# EAGLE design chess (EAGLE 7.6.0)
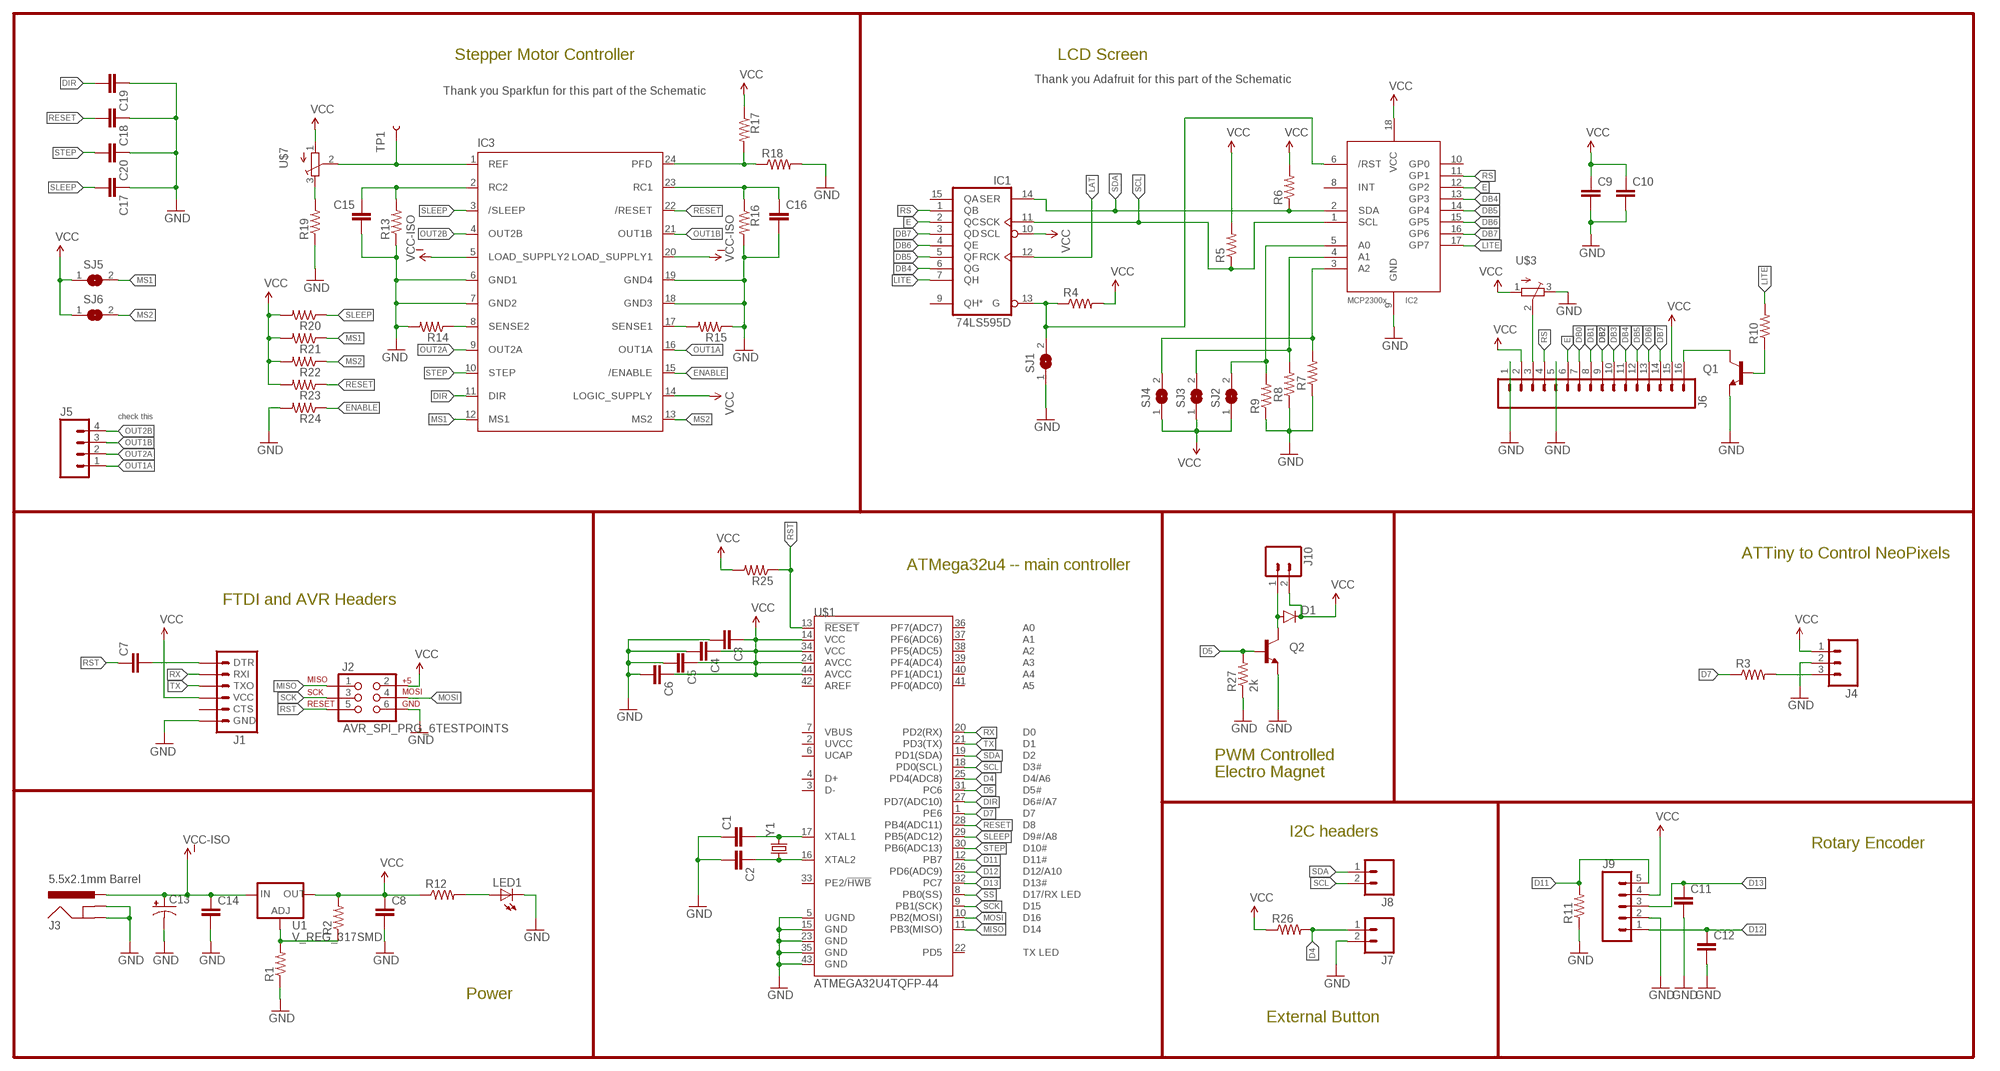
[diagram p0: schematic, sheet 1]

## Parts
C1  CAP0603-CAP  [0603-CAP]
C2  CAP0603-CAP  [0603-CAP]
C3  CAP0603-CAP  [0603-CAP]
C4  CAP0603-CAP  [0603-CAP]
C5  CAP0603-CAP  [0603-CAP]
C6  CAP0603-CAP  [0603-CAP]
C7  CAP0603-CAP  [0603-CAP]
C8  CAP0603-CAP  [0603-CAP]
C9  CAP0603-CAP  [0603-CAP]
C10  CAP0603-CAP  [0603-CAP]
C11  CAP0603-CAP  [0603-CAP]
C12  CAP0603-CAP  [0603-CAP]
C13  CAP_POL6032  [EIA6032]
C14  CAP0603-CAP  [0603-CAP]
C15  CAP0603-CAP  [0603-CAP]
C16  CAP0603-CAP  [0603-CAP]
C17  CAP0603-CAP  [0603-CAP]
C18  CAP0603-CAP  [0603-CAP]
C19  CAP0603-CAP  [0603-CAP]
C20  CAP0603-CAP  [0603-CAP]
D1  DIODEBAS16  [SOD-323]
IC1  74LS595D  [SO16]
IC2  MCP2300X/SO  [SO18W]
IC3  A3967SLB  [SO24W]
J1  ARDUINO_SERIAL_PROGRAMPTH  [1X06]
J2  AVR_SPI_PRG_6TESTPOINTS  [2X3_TEST_POINTS]
J3  5.5x2.1mm Barrel  POWER_JACKSMD  [POWER_JACK_SMD]
J4  M03PTH  [1X03]
J5  M04PTH  [1X04]
J6  M16PTH  [1X16]
J7  M02PTH  [1X02]
J8  M02PTH  [1X02]
J9  M05PTH  [1X05]
J10  M02PTH  [1X02]
LED1  LED1206  [LED-1206]
Q1  TRANSISTOR_NPNMMBT2222A  [SOT23-3]
Q2  TRANSISTOR_NPNTO-92-AMMO  [TO-92-AMMO]
R1  RESISTOR0603-RES  [0603-RES]
R2  RESISTOR0603-RES  [0603-RES]
R3  RESISTOR0603-RES  [0603-RES]
R4  RESISTOR0603-RES  [0603-RES]
R5  RESISTOR0603-RES  [0603-RES]
R6  RESISTOR0603-RES  [0603-RES]
R7  RESISTOR0603-RES  [0603-RES]
R8  RESISTOR0603-RES  [0603-RES]
R9  RESISTOR0603-RES  [0603-RES]
R10  RESISTOR0603-RES  [0603-RES]
R11  RESISTOR0603-RES  [0603-RES]
R12  RESISTOR0603-RES  [0603-RES]
R13  RESISTOR0603-RES  [0603-RES]
R14  RESISTOR0603-RES  [0603-RES]
R15  RESISTOR0603-RES  [0603-RES]
R16  RESISTOR0603-RES  [0603-RES]
R17  RESISTOR0603-RES  [0603-RES]
R18  RESISTOR0603-RES  [0603-RES]
R19  RESISTOR0603-RES  [0603-RES]
R20  RESISTOR0603-RES  [0603-RES]
R21  RESISTOR0603-RES  [0603-RES]
R22  RESISTOR0603-RES  [0603-RES]
R23  RESISTOR0603-RES  [0603-RES]
R24  RESISTOR0603-RES  [0603-RES]
R25  RESISTOR0603-RES  [0603-RES]
R26  RESISTOR0603-RES  [0603-RES]
R27  2k  RESISTOR0603-RES  [0603-RES]
SJ1  SJ  [SJ]
SJ2  SJ  [SJ]
SJ3  SJ  [SJ]
SJ4  SJ  [SJ]
SJ5  SJ  [SJ]
SJ6  SJ  [SJ]
TP1  TEST-POINT3X5  [PAD.03X.05]
U1  V_REG_317SMD  [SOT223]
U$1  ATMEGA32U4TQFP-44  [TQFP44]
U$3  TRIMPOTTC33X  [TC33X]
U$7  TRIMPOTTC33X  [TC33X]
Y1  CRYSTALCRYSTAL-SMD-5X3-12MHZ  [CRYSTAL-SMD-5X3]

## Nets
D4: J7.1 R26.2 U$1.25(PD4(ADC8))
D5: Q2.2(B) R27.2 U$1.31(PC6)
D7: R3.1 U$1.1(PE6)
D11: J9.5 R11.2 U$1.12(PB7)
D12: C12.1 J9.1 U$1.26(PD6(ADC9))
D13: C11.1 J9.3 U$1.32(PC7)
DB0: J6.7
DB1: J6.8
DB2: J6.9
DB3: J6.10
DB4: IC1.6(QG) IC2.13(GP3) J6.11
DB5: IC1.5(QF) IC2.14(GP4) J6.12
DB6: IC1.4(QE) IC2.15(GP5) J6.13
DB7: IC1.3(QD) IC2.16(GP6) J6.14
DIR: C19.2 IC3.11(DIR) U$1.27(PD7(ADC10))
E: IC1.2(QC) IC2.12(GP2) J6.6
ENABLE: IC3.15(/ENABLE) R24.1
GND: C1.1 C2.2 C3.2 C4.2 C5.2 C6.2 C8.2 C9.2 C10.2 C11.2 C12.2 C13.P$2(-) C14.2 C15.2 C16.2 C17.1 C18.1 C19.1 C20.1 IC2.9(GND) IC3.6(GND1) IC3.7(GND2) IC3.18(GND3) IC3.19(GND4) J1.6(GND) J2.6 J3.GND(GNDBREAK) J3.P$4(GND) J4.2 J6.1 J6.5 J7.2 J9.2 LED1.C Q1.2(E) Q2.1(E) R1.1 R7.1 R8.1 R9.1 R11.1 R13.1 R14.2 R15.1 R16.2 R18.2 R19.1 R24.2 R27.1 SJ1.1 U$1.5(UGND) U$1.15(GND) U$1.23(GND) U$1.35(GND) U$1.43(GND) U$3.3(E)
LAT: IC1.12(RCK)
LITE: IC1.7(QH) IC2.17(GP7) R10.2
MISO: J2.1 U$1.11(PB3(MISO))
MOSI: J2.4 U$1.10(PB2(MOSI))
MS1: IC3.12(MS1) R21.1 SJ5.2
MS2: IC3.13(MS2) R22.1 SJ6.2
N$1: C7.2 J1.1(DTR)
N$2: R1.2 R2.1 U1.1(ADJ)
N$3: D1.A J10.1 Q2.3(C)
N$5: IC3.8(SENSE2) R14.1
N$6: J4.3 R3.2
N$7: C2.1 U$1.16(XTAL2) Y1.1
N$8: C1.2 U$1.17(XTAL1) Y1.3
N$9: LED1.A R12.2
N$10: IC3.1(REF) TP1.P$1 U$7.2(S)
N$11: R19.2 U$7.3(E)
N$13: IC1.13(G) IC2.6(/RST) R4.1 SJ1.2
N$14: J6.3 U$3.2(S)
N$16: Q1.1(B) R10.1
N$27: C15.1 IC3.2(RC2) R13.2
N$28: J6.16 Q1.3(C)
N$29: IC2.5(A0) R9.2 SJ2.2
N$30: IC2.4(A1) R8.2 SJ3.2
N$31: IC2.3(A2) R7.2 SJ4.2
N$37: IC3.17(SENSE1) R15.2
N$38: C16.1 IC3.23(RC1) R16.1
N$40: IC3.24(PFD) R17.2 R18.1
OUT1A: IC3.16(OUT1A) J5.1
OUT1B: IC3.21(OUT1B) J5.3
OUT2A: IC3.9(OUT2A) J5.2
OUT2B: IC3.4(OUT2B) J5.4
RESET: C18.2 IC3.22(/RESET) R23.1 U$1.28(PB4(ADC11))
RS: IC1.1(QB) IC2.11(GP1) J6.4
RST: C7.1 J2.5 R25.1 U$1.13(!RESET)
RX: J1.2(RXI) U$1.20(PD2(RX))
SCK: J2.3 U$1.9(PB1(SCK))
SCL: IC1.11(SCK) IC2.1(SCL) J8.2 R5.1 U$1.18(PD0(SCL))
SDA: IC1.14(SER) IC2.2(SDA) J8.1 R6.1 U$1.19(PD1(SDA))
SLEEP: C17.2 IC3.3(/SLEEP) R20.1 U$1.29(PB5(ADC12))
SS: U$1.8(PB0(SS))
STEP: C20.2 IC3.10(STEP) U$1.30(PB6(ADC13))
TX: J1.3(TXO) U$1.21(PD3(TX))
VCC: C3.1 C4.1 C5.1 C6.1 C8.1 C9.1 C10.1 D1.C IC1.10(SCL) IC2.18(VCC) IC3.14(LOGIC_SUPPLY) J1.4(VCC) J2.2 J4.1 J6.2 J6.15 J9.4 J10.2 R2.2 R4.2 R5.2 R6.2 R12.1 R17.1 R20.2 R21.2 R22.2 R23.2 R25.2 R26.1 SJ2.1 SJ3.1 SJ4.1 SJ5.1 SJ6.1 U1.2(OUT) U$1.14(VCC) U$1.24(AVCC) U$1.34(VCC) U$1.44(AVCC) U$3.1(A) U$7.1(A)
VCC-ISO: C13.P$1(+) C14.1 IC3.5(LOAD_SUPPLY2) IC3.20(LOAD_SUPPLY1) J3.VIN0(PWR) U1.3(IN)
Unconnected: IC1.9(QH*) IC1.15(QA) IC2.8(INT) IC2.10(GP0) J1.5(CTS) U$1.2(UVCC) U$1.3(D-) U$1.4(D+) U$1.6(UCAP) U$1.7(VBUS) U$1.22(PD5) U$1.33(PE2/!HWB) U$1.36(PF7(ADC7)) U$1.37(PF6(ADC6)) U$1.38(PF5(ADC5)) U$1.39(PF4(ADC4)) U$1.40(PF1(ADC1)) U$1.41(PF0(ADC0)) U$1.42(AREF)

## Notes on the sheet
- Stepper Motor Controller | LCD Screen
- Thank you Adafruit for this part of the Schematic
- Thank you Sparkfun for this part of the Schematic
- check this
- ATTiny to Control NeoPixels
- ATMega32u4 -- main controller
- FTDI and AVR Headers
- PWM Controlled
  Electro Magnet
- I2C headers
- Rotary Encoder
- Power
- External Button

## Power pins joined to a net without a drawn wire
GND: IC1.8(GND)
VCC: IC1.16(VCC)

## Library data of the parts
C1-C12 C14-C20 = SparkFun-Passives:CAP: Capacitor Standard 0603 ceramic capacitor, and 0.1" leaded capacitor.
C13 = SparkFun-Capacitors:CAP_POL: Capacitor Polarized These are standard SMD and PTH capacitors. Normally 10uF, 47uF, and 100uF in electrolytic and tantalum varieties. Always verify the external diameter of the through hole cap, it varies with capacity, voltage, and manufacturer. The EIA devices should be standard.
D1 = SparkFun-DiscreteSemi:DIODE: Diode These are standard reverse protection diodes and small signal diodes. SMA package can handle up to about 1A. SOD-323 can handle about 200mA. What the SOD-323 package when ordering, there are some mfgs out there that are 5-pin packages.; PROD_ID: DIO-09646; VALUE: 250mA/100V
IC1 = LEDi2c74xx-us:74*595: 8-bit SHIFT REGISTER, output latch
IC2 = LEDi2cadafruit:MCP2300X: MCP23008 Inexpensive i2c i/o expander - 8 general purpose i/o pins with optional pullups
IC3 = Allegro:A3967SLB: ANALOG DEVICES
J1 = SparkFun-Connectors:ARDUINO_SERIAL_PROGRAM: FTDI connector footprints
J2 = SparkFun-Connectors:AVR_SPI_PRG_6: AVR ISP 6 Pin This is the reduced ISP connector for AVR programming. Common on Arduino. This footprint will take up less PCB space and can be used with a 10-pin to 6-pin adapter such as SKU: BOB-08508 **Special note about "TEST_POINT" package. The stop mask is on the top side, so if you want your programming test points to be on the bottom of your board, make sure to place this package on the bottom side of the board. This also ensure that the orientation to program from the bottom side will be correct.
J3 = SparkFun-Connectors:POWER_JACK: Power Jack This is the standard 5.5mm barrel jack for power. The PTH is the most common, proven, reliable, footprint. The Slot footprint only works if the mill layer is transmitted to the PCB fab house so be warned. Mating wall wart : TOL-00298 (and others); PROD_ID: CONN-08106; SF_ID: PRT-12748
J4 = SparkFun-Connectors:M03: Header 3 Standard 3-pin 0.1" header. Use with straight break away headers (SKU : PRT-00116), right angle break away headers (PRT-00553), swiss pins (PRT-00743), machine pins (PRT-00117), and female headers (PRT-00115). Molex polarized connector foot print use with SKU : PRT-08232 with associated crimp pins and housings.
J5 = SparkFun-Connectors:M04: Header 4 Standard 4-pin 0.1" header. Use with straight break away headers (SKU : PRT-00116), right angle break away headers (PRT-00553), swiss pins (PRT-00743), machine pins (PRT-00117), and female headers (PRT-00115). Molex polarized connector foot print use with SKU : PRT-08231 with associated crimp pins and housings. 1MM SMD Version SKU: PRT-10208; PROD_ID: CONN-09696
J6 = SparkFun-Connectors:M16: 1x16 .1" header
J7 J8 J10 = SparkFun-Connectors:M02: Standard 2-pin 0.1" header. Use with - straight break away headers ( PRT-00116) - right angle break away headers (PRT-00553) - swiss pins (PRT-00743) - machine pins (PRT-00117) - female headers (PRT-00115) Molex polarized connector foot print use with: PRT-08233 with associated crimp pins and housings. 2.54_SCREWTERM for use with PRT-10571. 3.5mm Screw Terminal footprints for PRT-08084 5mm Screw Terminal footprints for use with PRT-08432
J9 = SparkFun-Connectors:M05: Header 5 Standard 5-pin 0.1" header. Use with straight break away headers (SKU : PRT-00116), right angle break away headers (PRT-00553), swiss pins (PRT-00743), machine pins (PRT-00117), and female headers (PRT-00115). Molex polarized connector foot print use with SKU : PRT-08230 with associated crimp pins and housings.
LED1 = LilyPad-Wearables:LED: LEDs Standard schematic elements and footprints for 5mm, 3mm, 1206, and 0603 sized LEDs. 5mm - Spark Fun Electronics SKU : Comp-SBL
Q1 = SparkFun-DiscreteSemi:TRANSISTOR_NPN: Generic NPN BJT MMBT2222A - TRANS-08049 (SOT-23, 1A 40V) MPSA42 - TRANS-09116 (SOT-23, 500mA 300V) MMBT5088LT1G - TRANS-11160 (SOT-23, 50 mA 30V) BC547 - COM-08928 <http://www.sparkfun.com/products/8928> (TO-92 45V 100mA) (1.Collector 2.Base 3.Emitter) 2N3904 - COM-00521 <http://www.sparkfun.com/products/521> (TO-92 40V 200mA) (1.Emitter 2.Base 3.Collector) P2N2222A - COM-12852 <http://www.sparkfun.com/products/12852> (TO-92 40V 600mA) (1.Collector 2.Base 3.Emitter); PROD_ID: TRANS-08049; VALUE: MMBT2222A
Q2 = SparkFun-DiscreteSemi:TRANSISTOR_NPN: Generic NPN BJT MMBT2222A - TRANS-08049 (SOT-23, 1A 40V) MPSA42 - TRANS-09116 (SOT-23, 500mA 300V) MMBT5088LT1G - TRANS-11160 (SOT-23, 50 mA 30V) BC547 - COM-08928 <http://www.sparkfun.com/products/8928> (TO-92 45V 100mA) (1.Collector 2.Base 3.Emitter) 2N3904 - COM-00521 <http://www.sparkfun.com/products/521> (TO-92 40V 200mA) (1.Emitter 2.Base 3.Collector) P2N2222A - COM-12852 <http://www.sparkfun.com/products/12852> (TO-92 40V 600mA) (1.Collector 2.Base 3.Emitter)
R1-R27 = SparkFun-Passives:RESISTOR: Resistor Basic schematic elements and footprints for 0603, 1206, and PTH resistors.
SJ1-SJ6 = LEDi2cjumper:SJ: SMD solder JUMPER
TP1 = SparkFun-Passives:TEST-POINT: Bare copper test points for troubleshooting or ICT
U1 = SparkFun-PowerIC:V_REG_317: Voltage Regulator Standard LM317 adjustable voltage regulator. AOI (Adjust Output Input). Google 'LM317 Calculator' for easy to use app to get the two resistor values needed. 240/720 for 5V output. 240/390 for 3.3V output. Spark Fun Electronics SKU : COM-00527
U$1 = SparkFun-DigitalIC:ATMEGA32U4: Atmel 44-pin 8-bit Microcontroller with 32KBytes of ISP Flash and USB Controller
U$3 U$7 = LEDi2cadafruit:TRIMPOT: SMT trimmer potentiometer part number TC33X http://www.ladyada.net/library/eagle
Y1 = SparkFun-FreqCtrl:CRYSTAL: Various standard crystals. Proven footprints.; PROD_ID: XTAL-08297; VALUE: 12MHz

## Board
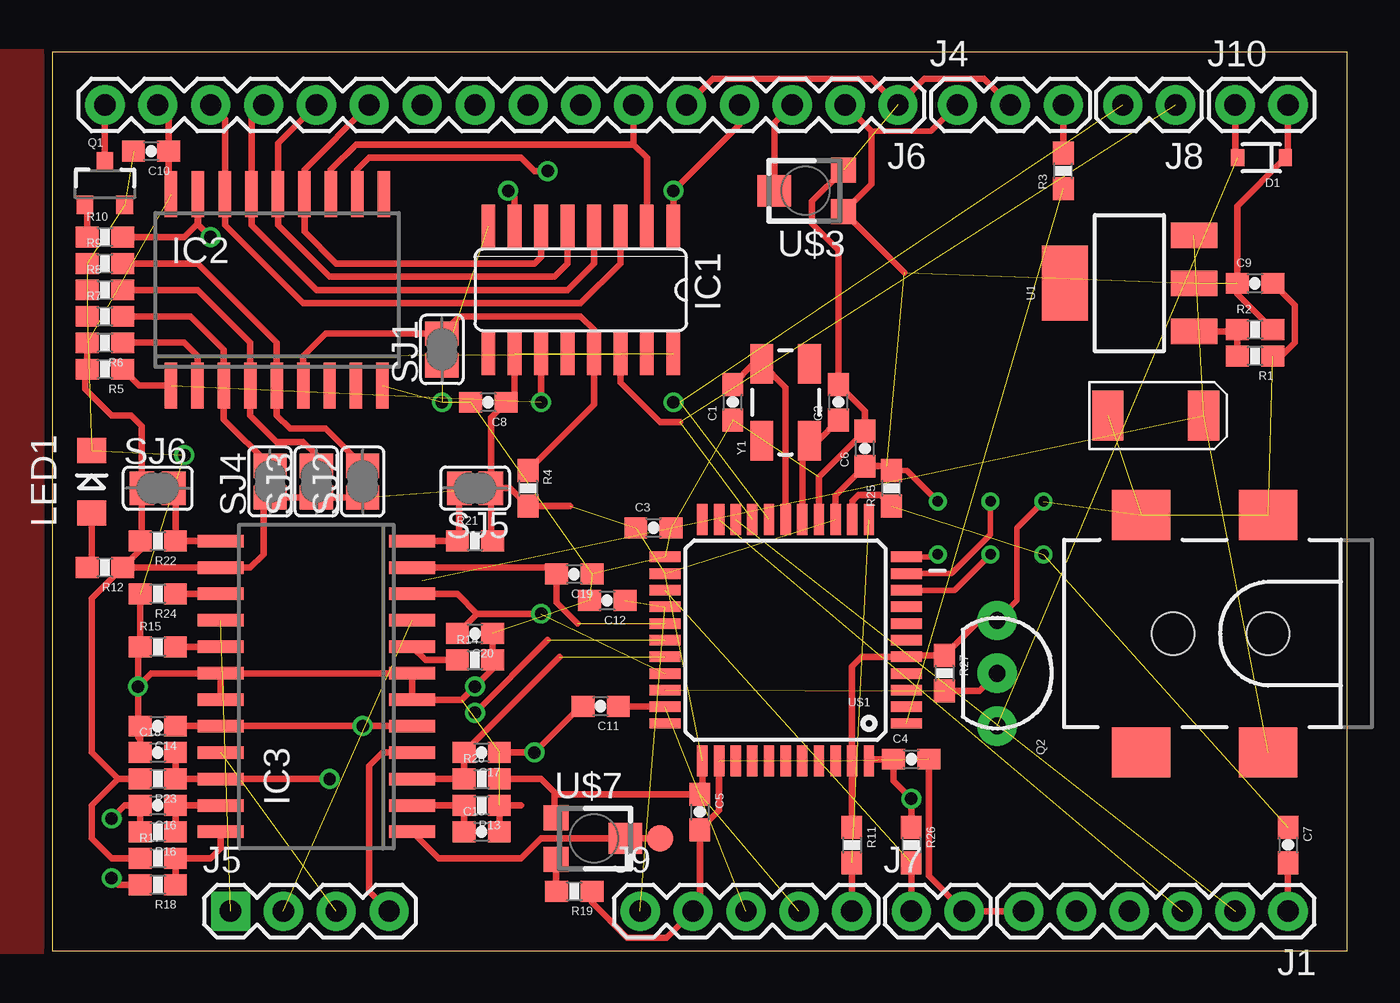
[diagram p1: board, top side]
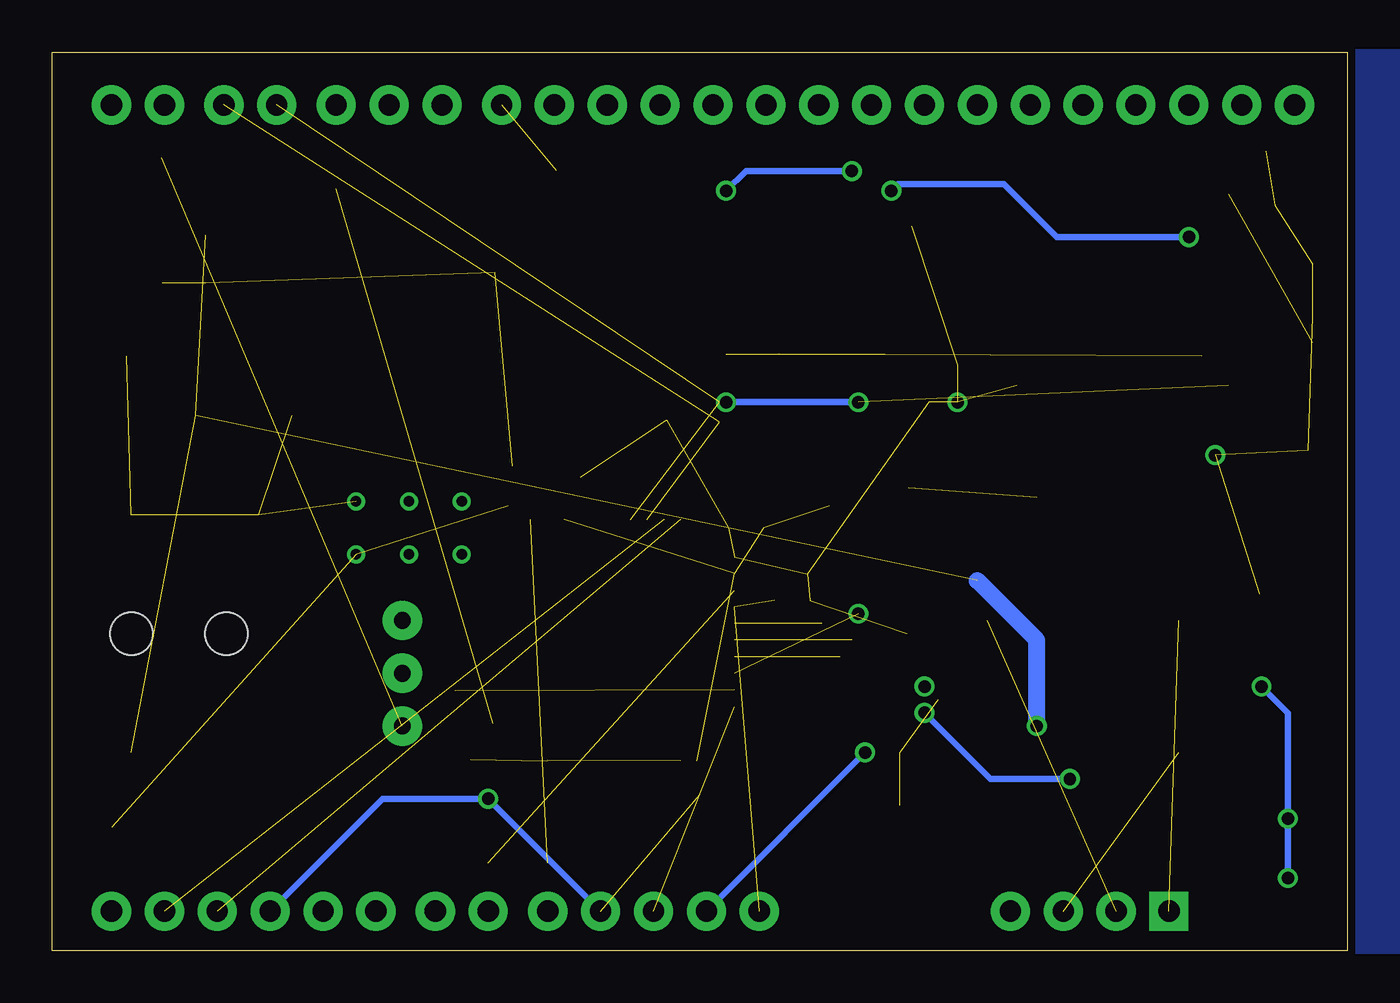
[diagram p2: board, bottom side, seen from below]

Size 62.23 x 43.18 mm. Coordinates in mm from the lower left corner, seen from the top.
Outline: 0,0 62.23,0 62.23,43.18 0,43.18 0,0
Copper layers (1*16): Top 0.0356mm / dielectric 1.5011mm / Bottom 0.0356mm
Design rules "LaenPCBOrder": minimum track width 6mil, minimum drill 13mil, track to track 6mil, track to pad 6mil, pad to pad 6mil, via to via 6mil, smd to smd 6mil, copper to edge 15mil, drill to drill 6mil, minimum pad ring 7mil, minimum via ring 7mil, stop-mask expansion 3mil, vias tented up to drill 0mil, thermal gap 10mil

### Footprints (pad centres in the part's own frame; a part is rotated, then mirrored left to right if it is on the bottom)
0603-CAP = smd 1.1 x 1: 1 -0.85,0; 2 0.85,0
EIA6032 = smd 1.5 x 2.4: P$1 -2.3,0; P$2 2.3,0
SOD-323 = smd 0.63 x 0.83: A 1.15,0; C -1.15,0
SO16 = smd 0.66 x 2.032: 1 -4.445,-3.073; 2 -3.175,-3.073; 3 -1.905,-3.073; 4 -0.635,-3.073; 5 0.635,-3.073; 6 1.905,-3.073; 7 3.175,-3.073; 8 4.445,-3.073; 9 4.445,3.073; 10 3.175,3.073; 11 1.905,3.073; 12 0.635,3.073; 13 -0.635,3.073; 14 -1.905,3.073; 15 -3.175,3.073; 16 -4.445,3.073
SO18W = smd 0.6 x 2.2: 1 -4.445,-4.6; 2 -3.175,-4.6; 3 -1.905,-4.6; 4 -0.635,-4.6; 5 0.635,-4.6; 6 1.905,-4.6; 7 3.175,-4.6; 8 4.445,-4.6; 9 5.715,-4.6; 10 5.775,4.6; 11 4.505,4.6; 12 3.235,4.6; 13 1.965,4.6; 14 0.695,4.6; 15 -0.575,4.6; 16 -1.845,4.6; 17 -3.145,4.6; 18 -4.445,4.6
SO24W = smd 0.6 x 2.2: 1 -6.985,-4.6; 2 -5.715,-4.6; 3 -4.445,-4.6; 4 -3.175,-4.6; 5 -1.905,-4.6; 6 -0.635,-4.6; 7 0.635,-4.6; 8 1.905,-4.6; 9 3.175,-4.6; 10 4.445,-4.6; 11 5.715,-4.6; 12 6.985,-4.6; 13 6.985,4.6; 14 5.715,4.6; 15 4.445,4.6; 16 3.175,4.6; 17 1.905,4.6; 18 0.635,4.6; 19 -0.635,4.6; 20 -1.905,4.6; 21 -3.175,4.6; 22 -4.445,4.6; 23 -5.715,4.6; 24 -6.985,4.6
1X06 = drill 1.016 pad 1.88: 1 0,0; 2 2.54,0; 3 5.08,0; 4 7.62,0; 5 10.16,0; 6 12.7,0
2X3_TEST_POINTS = drill 0.508: 1 -2.54,-1.27; 2 -2.54,1.27; 3 0,-1.27; 4 0,1.27; 5 2.54,-1.27; 6 2.54,1.27
POWER_JACK_SMD = smd 2.8 x 2.4: GND 0,-5.7; P$4 6.1,-5.7; VIN0 0,5.7; VIN1 6.1,5.7 | hole 2.032: 0,0; 4.572,0
1X03 = drill 1.016 pad 1.88: 1 0,0; 2 2.54,0; 3 5.08,0
1X04 = drill 1.016 pad 1.88 square: 1 0,0 | drill 1.016 pad 1.88: 2 2.54,0; 3 5.08,0; 4 7.62,0
1X16 = drill 1.016 pad 1.88: 1 0,0; 2 2.54,0; 3 5.08,0; 4 7.62,0; 5 10.16,0; 6 12.7,0; 7 15.24,0; 8 17.78,0; 9 20.32,0; 10 22.86,0; 11 25.4,0; 12 27.94,0; 13 30.48,0; 14 33.02,0; 15 35.56,0; 16 38.1,0
1X02 = drill 1.016 pad 1.88: 1 0,0; 2 2.54,0
1X05 = drill 1.016 pad 1.88: 1 0,0; 2 2.54,0; 3 5.08,0; 4 7.62,0; 5 10.16,0
LED-1206 = smd 1.2 x 1.4: A -1.5,0; C 1.5,0
SOT23-3 = smd 0.8 x 0.9: 1 -0.95,-1; 2 0.95,-1; 3 0,1.1
TO-92-AMMO = drill 0.813 pad 1.88: 1 -2.54,0; 2 0,0; 3 2.54,0
0603-RES = smd 1.1 x 1: 1 -0.85,0; 2 0.85,0
SJ = smd 1.168 x 1.6: 1 -0.762,0; 2 0.762,0
PAD.03X.05 = smd 1.27 x 1.27: P$1 0,0
SOT223 = smd 1.219 x 2.235: 1 -2.311,-3.099; 2 0,-3.099; 3 2.311,-3.099 | smd 3.6 x 2.2: 4 0,3.099
TQFP44 = smd 1.5 x 0.5: 1 -5.8,4; 2 -5.8,3.2; 3 -5.8,2.4; 4 -5.8,1.6; 5 -5.8,0.8; 6 -5.8,0; 7 -5.8,-0.8; 8 -5.8,-1.6; 9 -5.8,-2.4; 10 -5.8,-3.2; 11 -5.8,-4; 23 5.8,-4; 24 5.8,-3.2; 25 5.8,-2.4; 26 5.8,-1.6; 27 5.8,-0.8; 28 5.8,0; 29 5.8,0.8; 30 5.8,1.6; 31 5.8,2.4; 32 5.8,3.2; 33 5.8,4 | smd 0.5 x 1.5: 12 -4,-5.8; 13 -3.2,-5.8; 14 -2.4,-5.8; 15 -1.6,-5.8; 16 -0.8,-5.8; 17 0,-5.8; 18 0.8,-5.8; 19 1.6,-5.8; 20 2.4,-5.8; 21 3.2,-5.8; 22 4,-5.8; 34 4,5.8; 35 3.2,5.8; 36 2.4,5.8; 37 1.6,5.8; 38 0.8,5.8; 39 0,5.8; 40 -0.8,5.8; 41 -1.6,5.8; 42 -2.4,5.8; 43 -3.2,5.8; 44 -4,5.8
TC33X = smd 1.2 x 1.2: 1 -1,-1.825; 3 1,-1.825 | smd 1.5 x 1.6: 2 0,1.5
CRYSTAL-SMD-5X3 = smd 1.9 x 1.1: 1 -1.85,-1.15; 2 1.85,-1.15; 3 1.85,1.15; 4 -1.85,1.15

### Placement (x,y rotation side)
C1  32.7,26.35 90 top
C2  37.78,26.35 90 top
C3  28.89,20.32 0 top
C4  41.27,9.21 0 top
C5  31.11,6.67 270 top
C6  39.05,24.13 90 top
C7  59.37,5.08 270 top
C8  20.95,26.35 180 top
C9  57.78,32.07 0 top
C10  4.76,38.42 180 top
C11  26.35,11.75 180 top
C12  26.67,16.83 180 top
C13  53.02,25.72 180 top
C14  5.08,10.79 180 top
C15  20.64,5.71 0 top
C16  5.08,6.99 180 top
C17  20.64,9.53 180 top
C18  5.08,9.53 0 top
C19  25.08,18.1 180 top
C20  20.32,15.24 180 top
D1  58.1,38.1 180 top
IC1  25.4,31.75 180 top
IC2  10.16,31.75 0 top
IC3  12.7,12.7 90 top
J1  59.37,1.91 180 top
J2  45.09,20.32 0 top
J3  58.42,15.24 180 top
J4  43.5,40.64 0 top
J5  8.57,1.91 0 top
J6  40.64,40.64 180 top
J7  41.27,1.91 0 top
J8  53.98,40.64 180 top
J9  28.26,1.91 0 top
J10  56.83,40.64 0 top
LED1  1.91,22.54 90 top
Q1  2.54,36.83 0 top
Q2  45.4,13.34 270 top
R1  57.78,28.57 180 top
R2  57.78,29.84 0 top
R3  48.58,37.47 90 top
R4  22.86,22.23 270 top
R5  2.54,27.94 180 top
R6  2.54,29.21 180 top
R7  2.54,30.48 0 top
R8  2.54,31.75 0 top
R9  2.54,33.02 0 top
R10  2.54,34.29 0 top
R11  38.42,5.08 270 top
R12  2.54,18.41 180 top
R13  20.64,6.99 180 top
R14  20.32,13.97 0 top
R15  5.08,14.61 0 top
R16  5.08,5.71 180 top
R17  5.08,4.45 0 top
R18  5.08,3.17 180 top
R19  25.08,2.86 180 top
R20  20.64,8.26 0 top
R21  20.32,19.68 0 top
R22  5.08,19.68 180 top
R23  5.08,8.26 180 top
R24  5.08,17.14 180 top
R25  40.32,22.23 90 top
R26  41.27,5.08 270 top
R27  42.86,13.34 270 top
SJ1  18.73,28.89 90 top
SJ2  14.92,22.54 90 top
SJ3  12.7,22.54 90 top
SJ4  10.48,22.54 90 top
SJ5  20.32,22.23 180 top
SJ6  5.08,22.23 0 top
TP1  29.21,5.4 0 top
U1  51.75,32.07 90 top
U$1  35.24,14.92 180 top
U$3  36.2,36.51 90 top
U$7  26.04,5.4 270 top
Y1  35.24,26.35 90 top

### Tracks (layer width: path | path; a pad name or v marks a point on that pad's centre or on a via)
D4  (1 unrouted)
  Top 0.305: J7.1 R26.2
D5  (1 unrouted)
  Top 0.305: R27.2 44.55,12.48 Q2.2
D7  (1 unrouted)
D11  (1 unrouted)
  Top 0.305: R11.2 J9.5
D12  (2 unrouted)
D13  (1 unrouted)
  Top 0.305: U$1.32 29.42,11.75 C11.1
DB4
  Top 0.305: IC1.6 23.5,33.34 23.18,33.02 13.65,33.02 12.12,34.55 IC2.13 12.12,37.52 J6.11
DB5
  Top 0.305: IC1.5 24.77,33.02 24.13,32.38 13.34,32.38 10.86,34.87 IC2.14 10.86,38.8 J6.12
DB6
  Top 0.305: IC1.4 26.04,33.02 24.77,31.75 12.7,31.75 9.59,34.87 IC2.15 9.59,40.06 J6.13
DB7
  Top 0.305: IC1.3 27.3,33.02 25.4,31.11 12.06,31.11 8.31,34.87 IC2.16 8.31,39.95 J6.14
DIR  (1 unrouted)
  Top 0.305: IC3.11 23.91,18.41 C19.2 24.23,16.73 25.23,15.72
E
  Top 0.305: IC2.12 13.39,37.52 14.61,38.73 27.94,38.73 | IC1.2 28.57,38.1 27.94,38.73 | 27.94,38.73 J6.6
ENABLE
  Top 0.305: IC3.15 R24.1
GND  (via drill 0.6)  (27 unrouted)
  Top 0.254: J2.6 46.35,20.32 46.35,16.83 Q2.1
  Top 0.305: U$1.15 36.84,22.77 C6.2 39.05,25.93 C2.2 37.78,33.66 36.51,34.92 36.51,36.01 U$3.3 | J6.5 31.75,41.91 39.37,41.91 J6.1 41.91,41.91 44.77,41.91 J4.2 | C9.2 59.69,31.01 59.69,29.21 59.05,28.57 R1.1 | J1.6 J7.2 42.12,3.6 C4.2 | R19.1 25.93,2.33 27.62,0.64 29.53,0.64 J9.2 31.11,2.22 C5.2 32.04,6.75 U$1.35 | R11.1 38.42,9.1 U$1.43 38.42,9.15 38.42,13.65 38.89,14.12 U$1.5 41.1,14.19 R27.1 44.55,15.88 Q2.1 | IC3.18 IC3.7 IC3.6 19.68,12.06 v20.32,12.7 21.17,13.55 R14.2 C20.1 | C17.1 v23.18,9.53 25.4,11.75 C11.2 | C15.2 R13.1 22.54,6.99 | R16.2 C16.2 3.49,6.99 v2.86,6.35 | R18.2 3.17,3.17 v2.86,3.49 | C18.1 4.23,10.16 | 4.23,10.16 C14.2 | v4.13,12.7 4.13,10.26 4.23,10.16 | v4.13,12.7 4.76,13.34 IC3.18 | IC3.19 IC3.18 | v4.13,12.7 4.13,14.5 R15.1 R24.2
  Bottom 0.305: v23.18,9.53 J9.2 | v2.86,3.49 v2.86,6.35 2.86,11.43 v4.13,12.7
  other vias: 18.73,26.35 6.35,23.81
  pour Bottom: -0.32,0 -10.16,0 -10.16,43.18 -0.32,43.18
  pour Top: -0.32,0 -10.16,0 -10.16,43.18 -0.32,43.18
LITE  (via drill 0.6 pad 0.3)
  Top 0.305: R10.2 6.35,34.29 6.99,34.92 6.99,36.32 IC2.17 7.01,34.9 v7.62,34.29 | IC1.7 22.23,36.2 v21.91,36.51
  Bottom 0.305: v7.62,34.29 13.97,34.29 16.51,36.83 21.59,36.83 v21.91,36.51
MISO
  Top 0.254: U$1.11 42.42,18.92 J2.1
MOSI
  Top 0.254: U$1.10 43.2,18.12 45.09,20 J2.4
MS1
  Top 0.305: IC3.12 R21.1 19.56,19.77 SJ5.2
MS2
  Top 0.305: IC3.13 R22.1 5.93,22.14 SJ6.2
N$1
  Top 0.305: C7.2 J1.1
N$2
  Top 0.305: R1.2 R2.1 56.85,29.76 U1.1
N$3  (1 unrouted)
  Top 0.305: J10.1 56.83,38.22 D1.A
N$5
  Top 0.305: R14.1 17.93,13.97 IC3.8
N$6
  Top 0.305: R3.2 J4.3
N$7
  Top 0.305: C2.1 36.78,24.5 Y1.1 36.04,24.15 U$1.16
N$8
  Top 0.305: C1.2 33.7,28.2 Y1.3 35.24,27.05 U$1.17
N$9
  Top 0.305: R12.2 1.91,18.63 LED1.A
N$10
  Top 0.305: IC3.1 18.57,4.45 22.54,4.45 23.5,5.4 U$7.2 TP1.P$1
N$11
  Top 0.305: U$7.3 24.21,2.88 R19.2
N$13
  Top 0.305: IC2.6 12.06,28.57 13.14,29.65 SJ1.2 19.56,30.48 25.4,30.48 26.04,29.84 IC1.13 26.04,26.25 R4.1
N$14
  Top 0.305: U$3.2 34.7,39.77 J6.3
N$16
  Top 0.305: Q1.1 1.69,35.73 R10.1
N$27
  Top 0.305: IC3.2 R13.2 C15.1
N$28
  Top 0.305: Q1.3 J6.16
N$29
  Top 0.305: R9.2 6.99,33.02 10.79,29.21 IC2.5 10.79,25.72 11.43,25.08 13.14,25.08 SJ2.2
N$30
  Top 0.305: R8.2 6.99,31.75 9.53,29.21 IC2.4 9.53,25.72 10.79,24.45 12.06,24.45 12.7,23.81 SJ3.2
N$31
  Top 0.305: R7.2 6.67,30.48 8.26,28.89 IC2.3 8.26,25.53 SJ4.2
N$37
  Top 0.305: IC3.17 R15.2
N$38
  Top 0.305: IC3.23 C16.1 R16.1
N$40
  Top 0.305: IC3.24 8.1,4.92 7.62,4.45 R17.2 R18.1
OUT1A  (1 unrouted)
OUT1B  (1 unrouted)
OUT2A  (1 unrouted)
OUT2B
  Top 0.305: IC3.4 15.88,9.53 15.24,8.89 15.24,2.86 J5.4
RESET  (via drill 0.6)  (1 unrouted)
  Top 0.305: C18.2 R23.1 IC3.22 v13.34,8.26 | 23.81,14.92 v20.32,11.43
  Bottom 0.305: v20.32,11.43 17.14,8.26 v13.34,8.26
RS  (via drill 0.6 pad 0.3)
  Top 0.305: IC2.11 14.66,37.52 15.24,38.1 22.54,38.1 23.18,37.47 v23.81,37.47 | IC1.1 v29.84,36.51 33.02,39.69 J6.4
  Bottom 0.305: v29.84,36.51 28.89,37.47 v23.81,37.47
RST  (2 unrouted)
  Top 0.305: U$1.13 38.44,21.61 38.73,21.91 39.79,21.91 R25.1
RX  (1 unrouted)
SCK
  Top 0.254: U$1.9 43.36,17.32 J2.3
SCL  (via drill 0.6)  (3 unrouted)
  Top 0.305: R5.1 4.18,27.15 IC2.1 | 30.16,26.35 v29.84,26.35 | v23.5,26.35 IC1.11
  Bottom 0.305: v29.84,26.35 v23.5,26.35
SDA  (3 unrouted)
  Top 0.305: R6.1 6.35,29.21 6.99,28.57 IC2.2 | IC1.14 27.3,27.3 29.21,25.4 30.16,25.4
SLEEP  (1 unrouted)
  Top 0.305: IC3.3 R20.1 C17.2 24.39,14.12
STEP  (via drill 0.6)  (1 unrouted)
  Top 0.305: 20.42,16.19 C20.2 | IC3.10 19.47,17.14 20.42,16.19 | 20.42,16.19 v23.5,16.19
TX  (1 unrouted)
VCC  (via drill 0.6)  (11 unrouted)
  Top 0.254: 39.37,39.37 42.23,39.37 J4.1 | J2.2 41.06,23.07 R25.2
  Top 0.305: R6.2 R5.2 1.59,27.84 1.59,26.99 2.86,25.72 3.81,25.72 4.32,25.21 SJ6.1 4.32,19.77 R22.2 4.23,19.25 R12.1 | J6.2 39.37,39.37 39.37,36.83 38.05,35.51 U$3.1 40.96,32.58 | SJ2.1 SJ3.1 SJ4.1 10.16,21.46 10.16,19.05 9.53,18.41 IC3.14 R12.1 | J6.15 5.61,40.11 C10.1 5.61,36.45 IC2.18 | IC1.10 22.23,26.77 C8.1 21.08,25.63 SJ5.1 | R23.2 3.17,8.26 | R12.1 1.91,16.93 1.91,9.53 3.17,8.26 | R21.2 21.08,19.77 SJ5.1 | SJ5.1 21.3,22.44 | 24.88,21.38 R4.2 22.01,22.23 SJ5.1 | R20.2 23.5,8.26 24.13,7.62 | 24.13,7.62 24.13,6.48 U$7.1 | 24.13,7.62 24.23,7.52 C5.1 31.24,7.64 U$1.34 | R17.1 2.86,4.45 1.91,5.4 1.91,6.99 3.17,8.26 | U$1.14 37.64,21.87 C6.1 40.12,23.28 R25.2 | J10.2 59.37,38.22 D1.C 56.94,35.78 C9.1 56.94,31.55 R2.2 | U$1.44 39.33,9.21 C4.1 40.42,8.15 v41.27,7.3 R26.1
  Bottom 0.305: J9.4 v41.27,7.3 46.35,7.3 J1.4
VCC-ISO  (via drill 0.6)  (3 unrouted)
  Top 0.305: C14.1 IC3.20 v14.92,10.79 IC3.5
  Bottom 0.813: v14.92,10.79 14.92,14.92 17.78,17.78